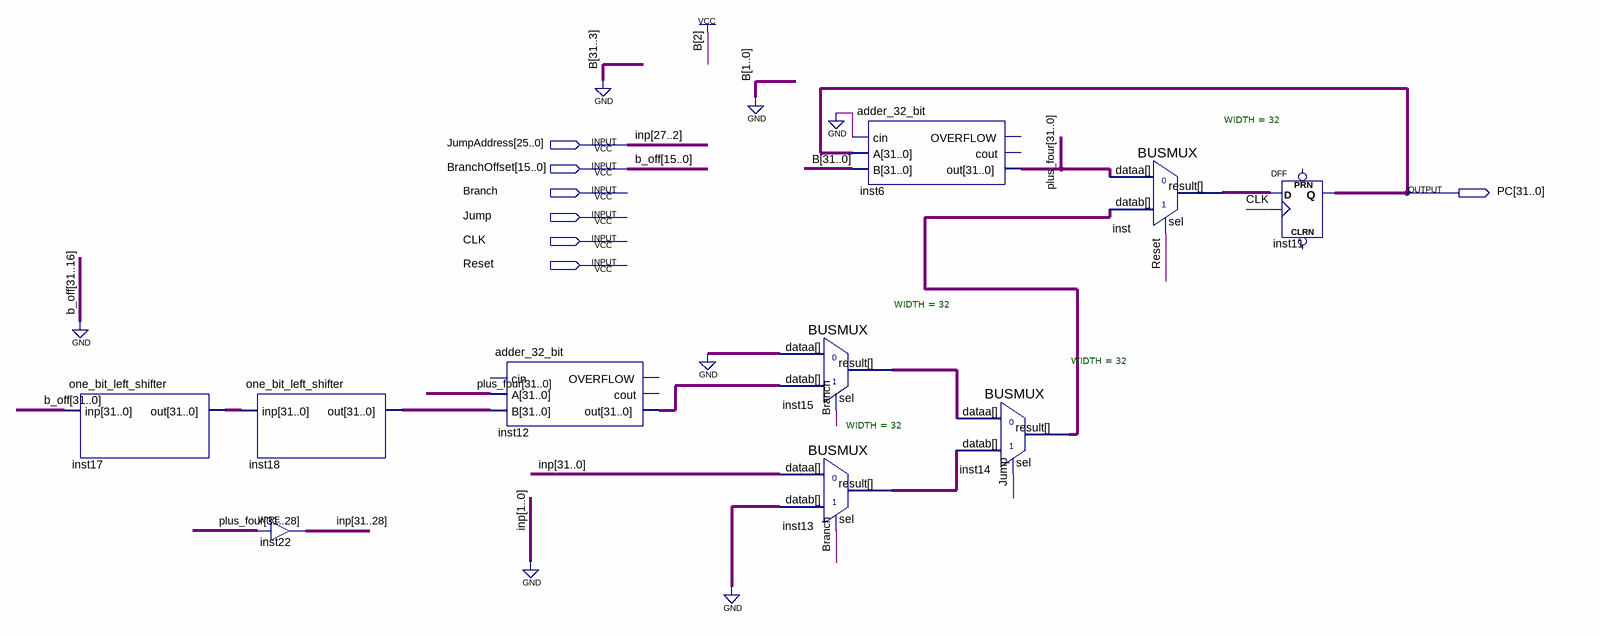
[diagram p0: schematic sheet]
// Quartus schematic PC.bdf as structural Verilog: 10 symbols, 7 pins
module PC (
  input  [25:0] JumpAddress,
  input  [15:0] BranchOffset,
  input  Branch,
  input  Jump,
  input  CLK,
  input  Reset,
  output [31:0] PC
);

  wire [31:0] inst12_out, inst13_result, inst14_result, inst15_result, inst17_out, inst18_out, inst_result,
       plus_four;
  wire [31:28] inp;

  one_bit_left_shifter inst17 (.inp({{16{1'b0}}, BranchOffset}), .out(inst17_out));
  one_bit_left_shifter inst18 (.inp(inst17_out), .out(inst18_out));
  assign inp = plus_four[31:28];  // WIRE inst22
  adder_32_bit inst12 (.A(plus_four), .B(inst18_out), .out(inst12_out));  // open: cin, OVERFLOW, cout
  BUSMUX #(.WIDTH(32)) inst15 (.datab(inst12_out), .sel(Branch), .dataa({32{1'b0}}), .result(inst15_result));
  BUSMUX #(.WIDTH(32)) inst13 (
    .datab({32{1'b0}}), .sel(Branch), .dataa({inp, JumpAddress, 2'b00}), .result(inst13_result));
  adder_32_bit inst6 (
    .cin(1'b0), .A(PC), .B(32'b00000000000000000000000000000100), .out(plus_four));  // open: OVERFLOW, cout
  BUSMUX #(.WIDTH(32)) inst14 (.datab(inst13_result), .sel(Jump), .dataa(inst15_result), .result(inst14_result));
  BUSMUX #(.WIDTH(32)) inst (.datab(inst14_result), .sel(Reset), .dataa(plus_four), .result(inst_result));
  DFF inst11[31:0] (.CLK(CLK), .D(inst_result), .Q(PC));  // open: CLRN, PRN

  // Other names for the same wires on the sheet: b_off[15:0] = BranchOffset; inp[27:2] = JumpAddress
endmodule
